# Altium project Laser.PrjPcb
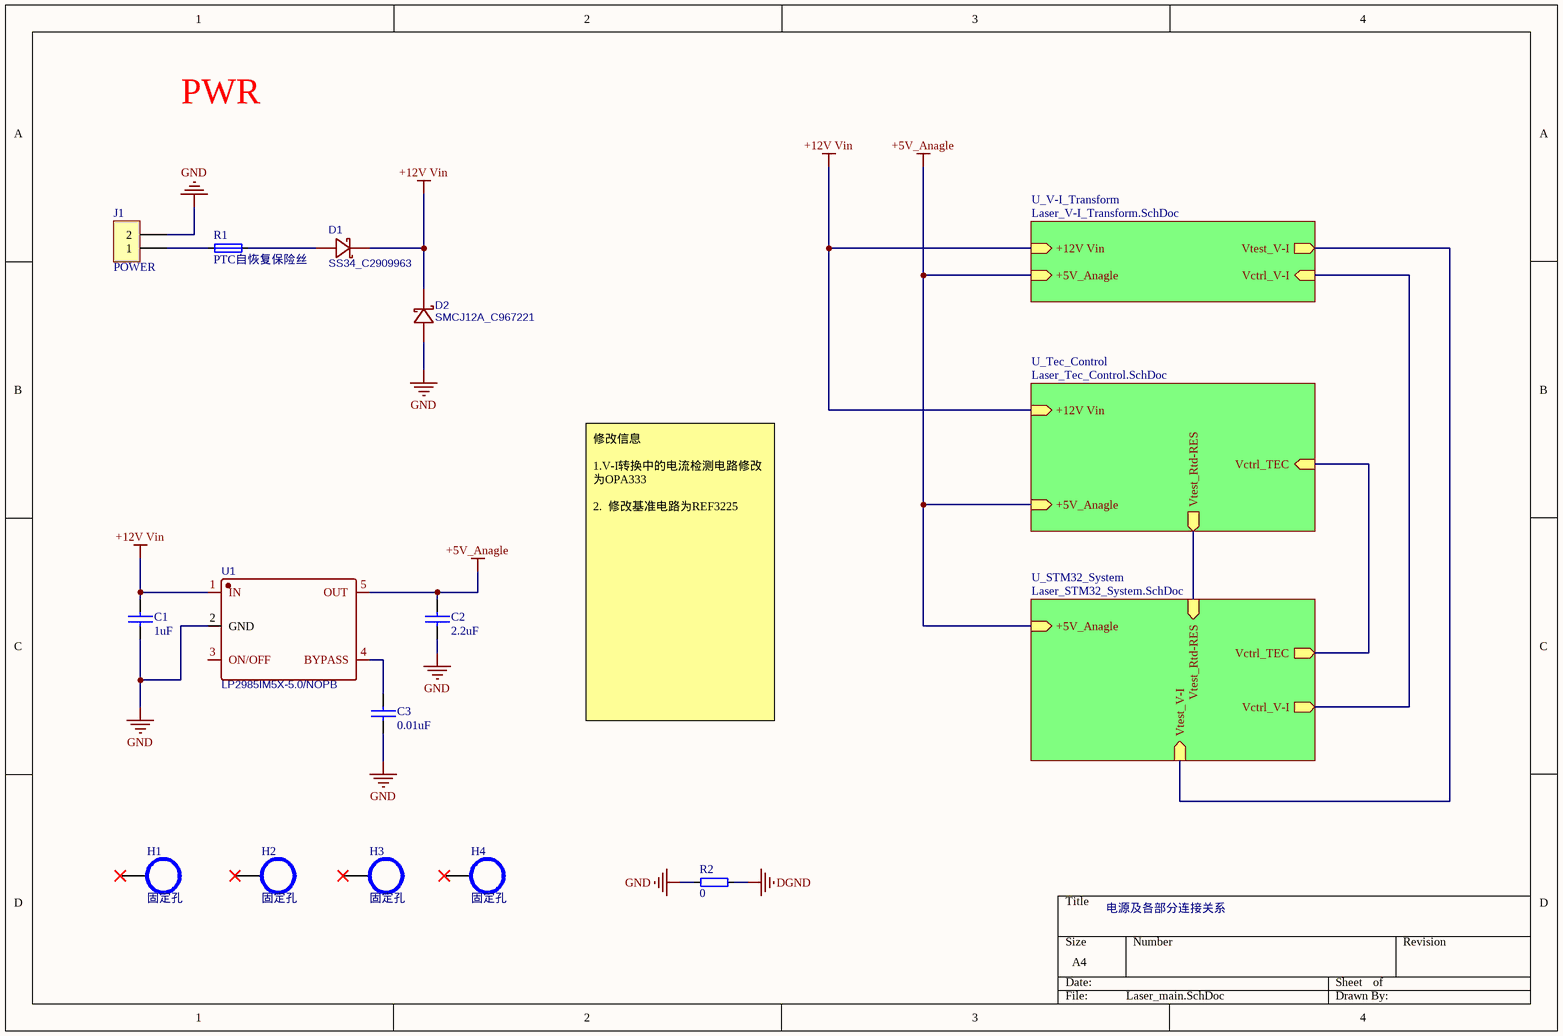
[diagram p0: Laser_main.SchDoc]
4 sheets, 112 parts. Net scope: hierarchical (ports join the sheet entries above them; power ports are global).
Board files: Laser_TFT_Display.PcbDoc, Laser.PcbDoc
Sheets:
  Laser_main.SchDoc
    U_V-I_Transform = Laser_V-I_Transform.SchDoc
    U_Tec_Control = Laser_Tec_Control.SchDoc
    U_STM32_System = Laser_STM32_System.SchDoc

## Sheet Laser_main.SchDoc: Main
size A4; SheetNumber: 1; SheetTotal: 4

### Parts
C1  1uF  [C 0603_M]
C2  2.2uF  [C 0603_M]
C3  0.01uF  [C 0603_M]
D1  SS34_C2909963  [SMA_L4.2-W2.7-LS5.0-RD]
D2  SMCJ12A_C967221  [SMC_L6.9-W5.9-LS8.0-RD]
H1  固定孔  [铜柱孔3]
H2  固定孔  [铜柱孔3]
H3  固定孔  [铜柱孔3]
H4  固定孔  [铜柱孔3]
J1  POWER  [KF128-5.08-2P]
R1  PTC自恢复保险丝  [0805R]
R2  0  [0603R]
U1  LP2985IM5X-5.0/NOPB  [SOT-23-5_L3.0-W1.7-P0.95-LS2.8-BR]

### Sub-sheets
U_STM32_System = Laser_STM32_System.SchDoc: +5V_Anagle (in), Vtest_Rtd-RES (in), Vtest_V-I (in), Vctrl_V-I (out), Vctrl_TEC (out)
U_Tec_Control = Laser_Tec_Control.SchDoc: +12V Vin (in), +5V_Anagle (in), Vctrl_TEC (in), Vtest_Rtd-RES (out)
U_V-I_Transform = Laser_V-I_Transform.SchDoc: Vctrl_V-I (in), Vtest_V-I (out), +5V_Anagle (in), +12V Vin (in)

### Nets
+5V_Anagle: C2.1 U1.5(OUT) ; sheet U_V-I_Transform/+5V_Anagle, sheet U_Tec_Control/+5V_Anagle, sheet U_STM32_System/+5V_Anagle
+12V Vin: C1.1 D1.1 D2.1(C) U1.1(IN) ; sheet U_V-I_Transform/+12V Vin, sheet U_Tec_Control/+12V Vin
DGND: R2.1
GND: C1.2 C2.2 C3.2 D2.2(A) J1.2 R2.2 U1.2(GND)
NetC3_1: C3.1 U1.4(BYPASS)
NetC8_1: sheet U_V-I_Transform/Vtest_V-I, sheet U_STM32_System/Vtest_V-I
NetC10_2: sheet U_V-I_Transform/Vctrl_V-I, sheet U_STM32_System/Vctrl_V-I
NetD1_2: D1.2 R1.2
NetJ1_1: J1.1 R1.1
NetJ3_1: sheet U_Tec_Control/Vtest_Rtd-RES, sheet U_STM32_System/Vtest_Rtd-RES
NetR21_1: sheet U_Tec_Control/Vctrl_TEC, sheet U_STM32_System/Vctrl_TEC

Not connected (* = marked no-connect by the designer): H1 11*; H2 11*; H3 11*; H4 11*; U1 3(ON/OFF)

### Notes on the sheet
- PWR
- 修改信息
  1.V-I转换中的电流检测电路修改为OPA333
  2.  修改基准电路为REF3225
- 电源及各部分连接关系

### Library data of the parts
C1-C3 = 普通电容: Capacitor
D1 = SS34_C2909963: BOM_Manufacturer: YONGYUTAI(永裕泰); BOM_Manufacturer Part: SS34; Contributor: LCSC; BOM_Supplier: LCSC; BOM_Supplier Part: C2909963; BOM_JLCPCB Part Class: Extended Part; spicePre: D; spiceSymbolName: SS34_C2909963
D2 = SMCJ12A_C967221: BOM_Manufacturer: Boarden(宝宫); Contributor: LCSC; BOM_Supplier: LCSC; BOM_Supplier Part: C967221; BOM_Manufacturer Part: SMCJ12A; spicePre: D; spiceSymbolName: SMCJ12A_C967221
J1 = SIP2: jointbar
R2 = 普通电阻: 电阻精度为0.1%
U1 = LP2985IM5X-5.0/NOPB: BOM_Manufacturer: Texas Instruments; Contributor: LCSC; BOM_Supplier: LCSC; BOM_Supplier Part: C73908; BOM_Manufacturer Part: LP2985IM5X-5.0/NOPB; BOM_JLCPCB Part Class: Extended Part; spicePre: U; spiceSymbolName: LP2985IM5X-5.0/NOPB

## Sheet Laser_V-I_Transform.SchDoc
size A4; SheetNumber: 2; SheetTotal: 4
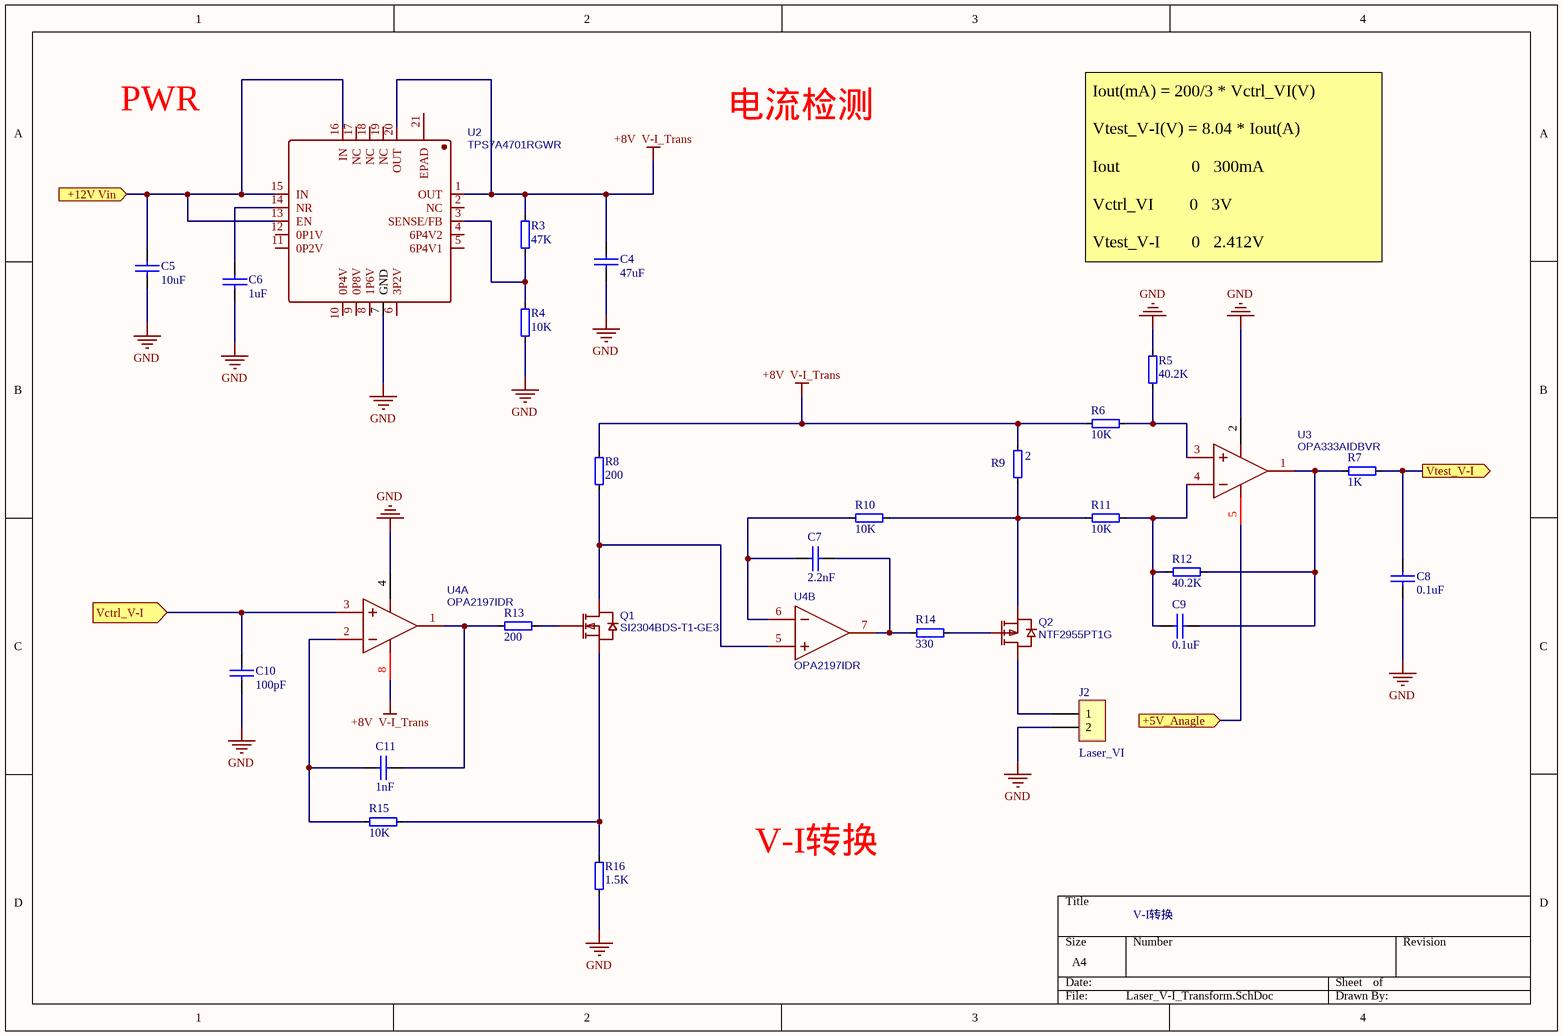
[diagram p1: Laser_V-I_Transform.SchDoc]

### Parts
C4  47uF  [C 0603_M]
C5  10uF  [C 0603_M]
C6  1uF  [C 0603_M]
C7  2.2nF  [C 0603_M]
C8  0.1uF  [C 0603_M]
C9  0.1uF  [C 0603_M]
C10  100pF  [C 0603_M]
C11  1nF  [C 0603_M]
J2  Laser_VI  [KF128-5.08-2P]
Q1  SI2304BDS-T1-GE3  [SOT-23_L2.9-W1.3-P1.90-LS2.4-BR]
Q2  NTF2955PT1G  [SOT-223-4_L6.5-W3.5-P2.30-LS7.0-BR]
R3  47K  [0603R]
R4  10K  [0603R]
R5  40.2K  [0603R]
R6  10K  [0603R]
R7  1K  [0603R]
R8  200  [0603R]
R9  2  [0603R]
R10  10K  [0603R]
R11  10K  [0603R]
R12  40.2K  [0603R]
R13  200  [0603R]
R14  330  [0603R]
R15  10K  [0603R]
R16  1.5K  [0603R]
U2  TPS7A4701RGWR  [VQFN-20_L5.0-W5.0-P0.65-TL-EP]
U3  OPA333AIDBVR  [SOT-23-5_L3.0-W1.7-P0.95-LS2.8-BR]
U4  OPA2197IDR  [SOIC-8_L4.9-W3.9-P1.27-LS6.0-BL]  (parts A,B of 2)

### Ports
+5V_Anagle (in), +12V Vin (in), Vctrl_V-I (in), Vtest_V-I (out)

### Nets
+5V_Anagle: U3.5(V+) ; port +5V_Anagle
+8V  V-I_Trans: C4.2 R3.2 R6.1 R8.1 R9.1 U2.1(OUT) U2.20(OUT) U4.8(V+)
+12V Vin: C5.1 U2.13(EN) U2.15(IN) U2.16(IN) ; port +12V Vin
GND: C4.1 C5.2 C6.2 C8.2 C10.1 J2.2 R4.1 R5.2 R16.2 U2.7(GND) U3.2(V-) U4.4(V-)
NetC6_1: C6.1 U2.14(NR)
NetC7_1: C7.1 R14.2 U4.7(OUT_A)
NetC7_2: C7.2 R10.1 U4.6(IN_A-)
NetC8_1: C8.1 R7.2 ; port Vtest_V-I
NetC9_1: C9.1 R7.1 R12.2 U3.1(OUT)
NetC9_2: C9.2 R11.2 R12.1 U3.4(IN-)
NetC10_2: C10.2 U4.3(IN_A+) ; port Vctrl_V-I
NetC11_1: C11.1 R13.2 U4.1(OUT_A)
NetC11_2: C11.2 R15.2 U4.2(IN_A-)
NetJ2_1: J2.1 Q2.2(D)
NetQ1_1: Q1.1(G) R13.1
NetQ1_2: Q1.2(S) R15.1 R16.1
NetQ1_3: Q1.3(D) R8.2 U4.5(IN_A+)
NetQ2_1: Q2.1(G) R14.1
NetQ2_3: Q2.3(S) R9.2 R10.2 R11.1
NetR3_1: R3.1 R4.2 U2.3(SENSE/FB)
NetR5_1: R5.1 R6.2 U3.3(IN+)

Not connected (* = marked no-connect by the designer): U2 2(NC) 4(6P4V2) 5(6P4V1) 6(3P2V) 8(1P6V) 9(0P8V) 10(0P4V) 11(0P2V) 12(0P1V) 17(NC) 18(NC) 19(NC) 21(EPAD)

### Notes on the sheet
- PWR
- 电流检测
- Iout(mA) = 200/3 * Vctrl_VI(V)
  Vtest_V-I(V) = 8.04 * Iout(A)
  Iout                0   300mA
  Vctrl_VI        0   3V
  Vtest_V-I       0   2.412V
- V-I转换

### Library data of the parts
C4-C11 = 普通电容: Capacitor
J2 = SIP2: jointbar
Q1 = SI2304BDS-T1-GE3: BOM_Manufacturer: VISHAY; BOM_Supplier: LCSC; BOM_Manufacturer Part: SI2304BDS-T1-GE3; BOM_Supplier Part: C81446; BOM_JLCPCB Part Class: Extended Part; spicePre: Q; spiceSymbolName: SI2304BDS-T1-GE3
Q2 = NTF2955PT1G: BOM_Manufacturer: VBsemi Elec; Contributor: LCSC; BOM_Supplier: LCSC; BOM_Supplier Part: C710036; BOM_Manufacturer Part: NTF2955PT1G; BOM_JLCPCB Part Class: Extended Part; spicePre: Q; spiceSymbolName: NTF2955PT1G
R3 R4 R8 R16 = 普通电阻: 电阻精度为0.1%
R5-R7 R10-R15 = 普通电阻
R9 = 采样电阻: 采样电阻，电阻精度为0.1%
U2 = TPS7A4701RGWR: BOM_Manufacturer: Texas Instruments; Contributor: LCSC; BOM_Supplier: LCSC; BOM_Supplier Part: C90084; BOM_Manufacturer Part: TPS7A4701RGWR; BOM_JLCPCB Part Class: Extended Part; spicePre: U; spiceSymbolName: TPS7A4701RGWR
U3 = OPA333AIDBVR: BOM_Manufacturer: TI; Contributor: LCSC; BOM_Supplier: LCSC; BOM_Manufacturer Part: OPA333AIDBVR; BOM_Supplier Part: C30878; BOM_JLCPCB Part Class: Extended Part; spicePre: U; spiceSymbolName: OPA333AIDBVR
U4 = OPA2197IDR: BOM_Manufacturer: TI; Contributor: LCSC; BOM_Supplier: LCSC; BOM_Manufacturer Part: OPA2197IDR; BOM_Supplier Part: C139363; BOM_JLCPCB Part Class: Extended Part; spicePre: U; spiceSymbolName: OPA2197IDR

## Sheet Laser_Tec_Control.SchDoc
size A4; SheetNumber: 3; SheetTotal: 4
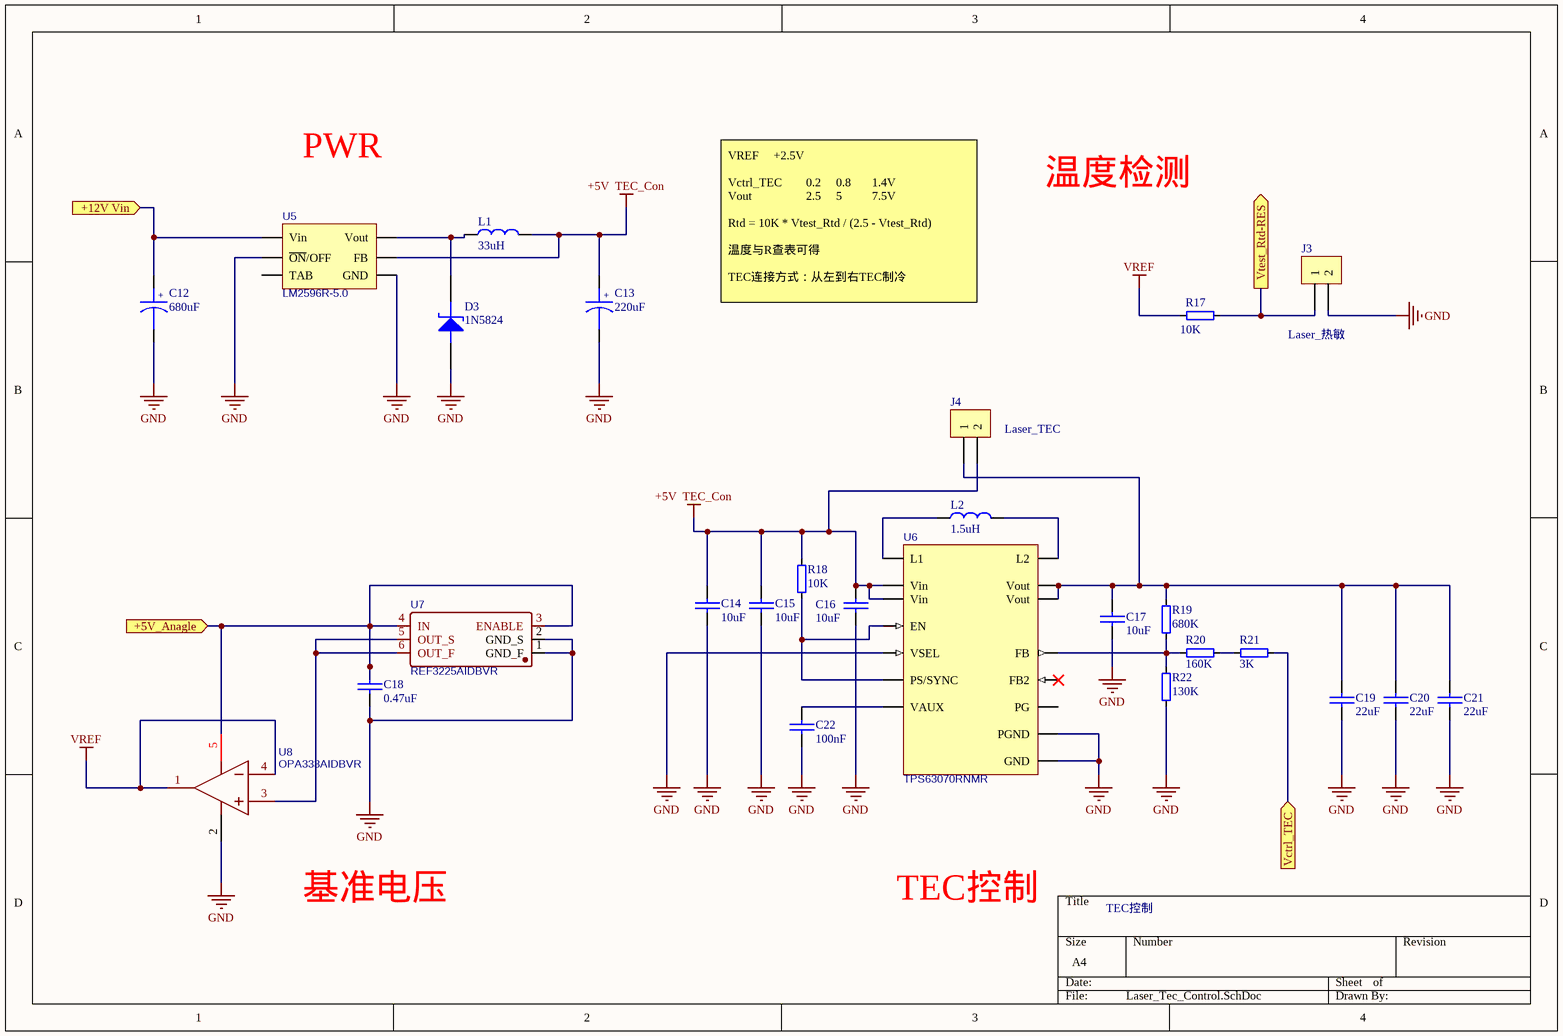
[diagram p2: Laser_Tec_Control.SchDoc]

### Parts
C12  680uF  [CAP-TH_BD8.0-P3.50-D0.6-FD]
C13  220uF  [CAP-TH_BD8.0-P3.50-D0.6-FD]
C14  10uF  [C 0603_M]
C15  10uF  [C 0603_M]
C16  10uF  [C 0603_M]
C17  10uF  [C 0603_M]
C18  0.47uF  [C 0603_M]
C19  22uF  [C 0603_M]
C20  22uF  [C 0603_M]
C21  22uF  [C 0603_M]
C22  100nF  [C 0603_M]
D3  1N5824  [SMA_L4.3-W2.6-LS5.0-RD]
J3  Laser_热敏  [KF128-5.08-2P]
J4  Laser_TEC  [KF128-5.08-2P]
L1  33uH  [L 0805]
L2  1.5uH  [L 0805]
R17  10K  [0603R]
R18  10K  [0603R]
R19  680K  [0603R]
R20  160K  [0603R]
R21  3K  [0603R]
R22  130K  [0603R]
U5  LM2596R-5.0  [TO-263-5_L10.2-W8.6-P1.70-LS14.4-TL]
U6  TPS63070RNMR  [VQFN-HR-15_L3.0-W2.5-P0.50-BL_TPS63070RNMR]
U7  REF3225AIDBVR  [SOT-23-6_L2.9-W1.6-P0.95-LS2.8-BL]
U8  OPA333AIDBVR  [SOT-23-5_L3.0-W1.7-P0.95-LS2.8-BR]

### Ports
+5V_Anagle (in), +12V Vin (in), Vctrl_TEC (in), Vtest_Rtd-RES (out)

### Nets
+5V  TEC_Con: C13.1 C14.1 C15.1 C16.1 J4.2 L1.1 R18.2 U5.4(FB) U6.12(Vin) U6.13(Vin)
+5V_Anagle: C18.1 U7.3(ENABLE) U7.4(IN) U8.5(V+) ; port +5V_Anagle
+12V Vin: C12.1 U5.1(Vin) ; port +12V Vin
GND: C12.2 C13.2 C14.2 C15.2 C16.2 C17.2 C18.2 C19.2 C20.2 C21.2 C22.2 D3.1(A) J3.2 R22.1 U5.3(GND) U5.5(~{ON}/OFF) U6.4(GND) U6.10(PGND) U6.15(VSEL) U7.1(GND_F) U7.2(GND_S) U8.2(V-)
VREF: R17.1 U8.1(OUT) U8.4(IN-)
NetC17_1: C17.1 C19.1 C20.1 C21.1 J4.1 R19.2 U6.7(Vout) U6.8(Vout)
NetC22_1: C22.1 U6.3(VAUX)
NetD3_2: D3.2(K) L1.2 U5.2(Vout)
NetJ3_1: J3.1 R17.2 ; port Vtest_Rtd-RES
NetL2_1: L2.1 U6.9(L2)
NetL2_2: L2.2 U6.11(L1)
NetR18_1: R18.1 U6.1(PS/SYNC) U6.14(EN)
NetR19_1: R19.1 R20.2 R22.2 U6.5(FB)
NetR20_1: R20.1 R21.2
NetR21_1: R21.1 ; port Vctrl_TEC
NetU7_5: U7.5(OUT_S) U7.6(OUT_F) U8.3(IN+)

Not connected (* = marked no-connect by the designer): U5 6(TAB); U6 2(PG) 6(FB2)*

### Notes on the sheet
- PWR
- 温度检测
- VREF     +2.5V
  Vctrl_TEC        0.2     0.8       1.4V
  Vout                  2.5     5          7.5V
  Rtd = 10K * Vtest_Rtd / (2.5 - Vtest_Rtd)
  温度与R查表可得
  TEC连接方式：从左到右TEC制冷
- 基准电压
- TEC控制
- (in symbol 电解电容1) +

### Library data of the parts
C12 C13 = 电解电容1: Capacitor
C14 C20 C21 = 普通电容: Capacitor 0805
C15 C19 = 普通电容: Capacitor,0805
C16 C17 = 普通电容: Capacitor,0603
C18 C22 = 普通电容: Capacitor
D3 = 1N5824: Zener Diode
J3 J4 = SIP2: jointbar
L1 L2 = L1: 电感
R17-R22 = 普通电阻
U5 = LM2596R-5.0: BOM_Manufacturer: HTC; BOM_Supplier: LCSC; BOM_Manufacturer Part: LM2596R-5.0; BOM_Supplier Part: C77782; BOM_JLCPCB Part Class: Extended Part; spicePre: U; spiceSymbolName: LM2596R-5.0
U6 = TPS63070RNMR: BOM_Manufacturer: TI; BOM_Supplier: LCSC; BOM_Manufacturer Part: TPS63070RNMR; BOM_Supplier Part: C109322; BOM_JLCPCB Part Class: Extended Part; spicePre: U; spiceSymbolName: TPS63070RNMR
U7 = REF3225AIDBVR: BOM_Manufacturer: TI; BOM_Supplier: LCSC; BOM_Manufacturer Part: REF3225AIDBVR; BOM_Supplier Part: C40852; BOM_JLCPCB Part Class: Extended Part; spicePre: U; spiceSymbolName: REF3225AIDBVR
U8 = OPA333AIDBVR: BOM_Manufacturer: TI; Contributor: LCSC; BOM_Supplier: LCSC; BOM_Manufacturer Part: OPA333AIDBVR; BOM_Supplier Part: C30878; BOM_JLCPCB Part Class: Extended Part; spicePre: U; spiceSymbolName: OPA333AIDBVR

## Sheet Laser_STM32_System.SchDoc
size A4; SheetNumber: 4; SheetTotal: 4
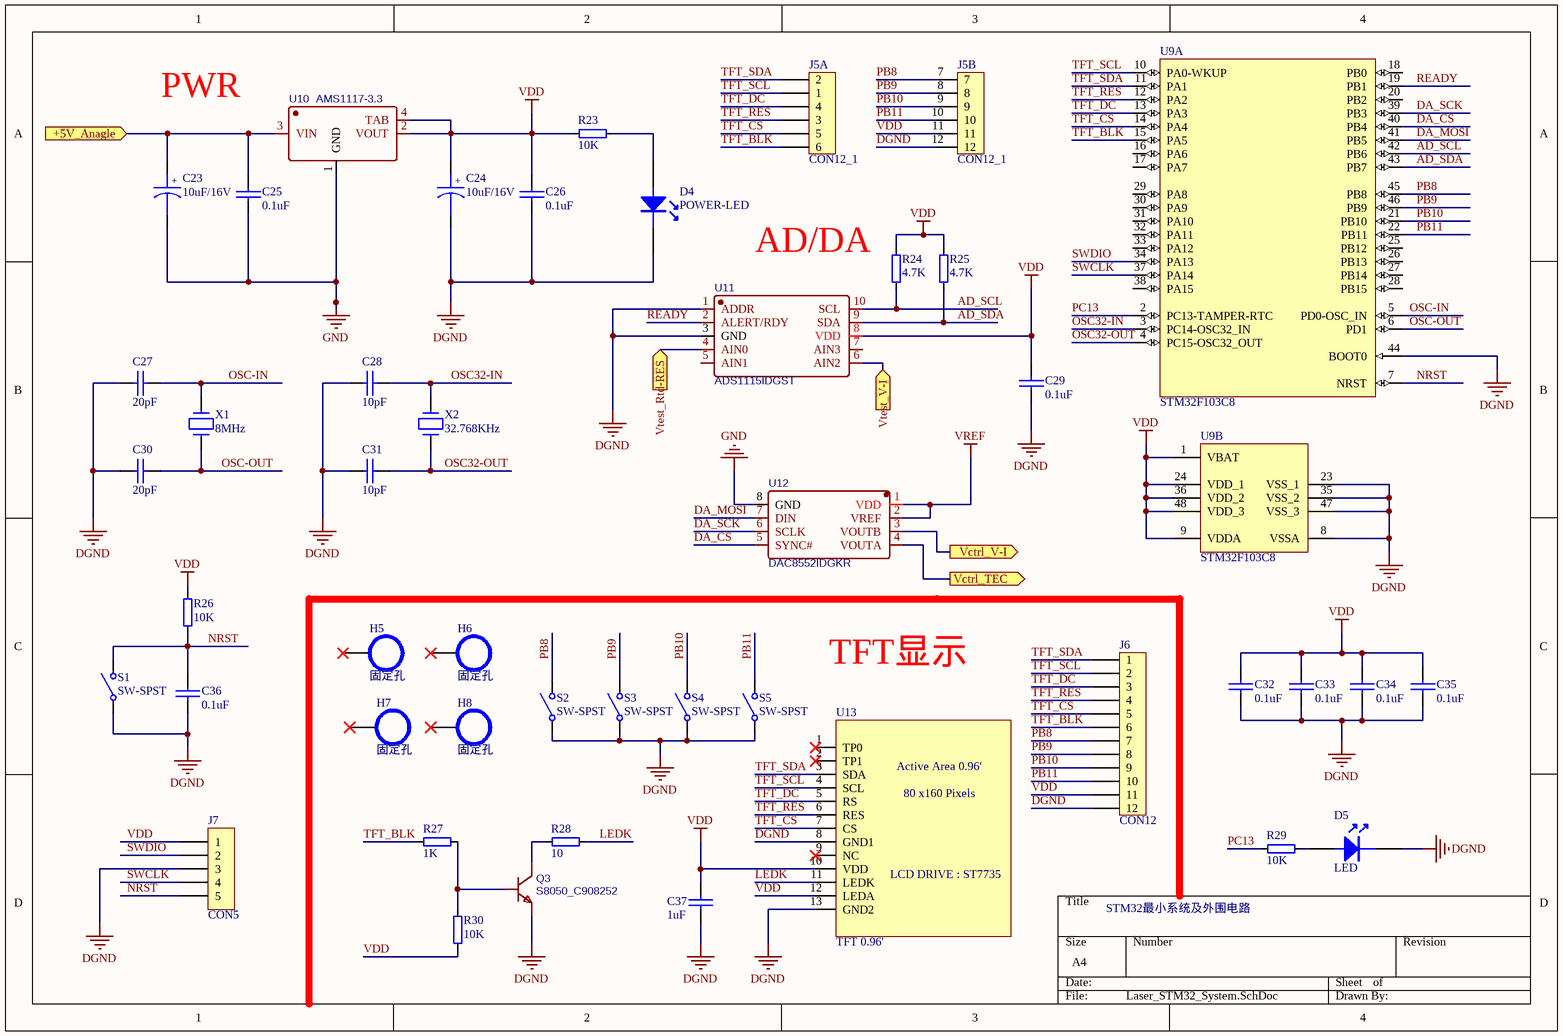
[diagram p3: Laser_STM32_System.SchDoc]

### Parts
C23  10uF/16V  [CAP-TH_BD5.0-P2.00-D0.8-FD]
C24  10uF/16V  [CAP-TH_BD5.0-P2.00-D0.8-FD]
C25  0.1uF  [C 0603_M]
C26  0.1uF  [C 0603_M]
C27  20pF  [C 0603_M]
C28  10pF  [C 0603_M]
C29  0.1uF  [C 0603_M]
C30  20pF  [C 0603_M]
C31  10pF  [C 0603_M]
C32  0.1uF  [C 0603_M]
C33  0.1uF  [C 0603_M]
C34  0.1uF  [C 0603_M]
C35  0.1uF  [C 0603_M]
C36  0.1uF  [C 0603_M]
C37  1uF  [C 0603_M]
D4  POWER-LED  [LED 0805R]
D5  LED  [LED 0805R]
H5  固定孔  [铜柱孔3]
H6  固定孔  [铜柱孔3]
H7  固定孔  [铜柱孔3]
H8  固定孔  [铜柱孔3]
J5  CON12_1  [XH2.54-WI-12P]  (parts A,B of 2)
J6  CON12  [XH2.54-WI-12P]
J7  CON5  [HDR2.54-LI-5P]
Q3  S8050_C908252  [SOT-23-3_L2.9-W1.3-P1.90-LS2.4-BR]
R23  10K  [0603R]
R24  4.7K  [0603R]
R25  4.7K  [0603R]
R26  10K  [0603R]
R27  1K  [0603R]
R28  10  [0603R]
R29  10K  [0603R]
R30  10K  [0603R]
S1  SW-SPST  [TSW SMD-3*6*2.5]
S2  SW-SPST  [TSW DIP-6*6*5]
S3  SW-SPST  [TSW DIP-6*6*5]
S4  SW-SPST  [TSW DIP-6*6*5]
S5  SW-SPST  [TSW DIP-6*6*5]
U9  STM32F103C8  [LQFP-48_L7.0-W7.0-P0.50-LS9.0-BL]  (parts A,B of 2)
U10  AMS1117-3.3  [SOT-223-4_L6.5-W3.5-P2.30-LS7.0-BR]
U11  ADS1115IDGST  [VSSOP-10_L3.0-W3.0-P0.50-LS4.9-BL]
U12  DAC8552IDGKR  [VSSOP-8_L3.0-W3.0-P0.65-LS5.0-BL]
U13  TFT 0.96'  [TFT0.96-13P]
X1  8MHz  [OSC HC-49S]
X2  32.768KHz  [OSC-3x8-LI]

### Ports
+5V_Anagle (in), Vctrl_TEC (out), Vctrl_V-I (out), Vtest_Rtd-RES (in), Vtest_V-I (in)

### Nets
+5V_Anagle: C23.1 C25.1 U10.3(VIN) ; port +5V_Anagle
DGND: C24.2 C26.2 C27.1 C28.1 C29.2 C30.1 C31.1 C32.2 C33.2 C34.2 C35.2 C36.2 C37.1 D4.2 D5.2 J5.12 J6.12 J7.3 Q3.2(E) S1.1(COMMON) S2.1(COMMON) S3.1(COMMON) S4.1(COMMON) S5.1(COMMON) U9.8(VSSA) U9.23(VSS_1) U9.35(VSS_2) U9.44(BOOT0) U9.47(VSS_3) U11.1(ADDR) U11.3(GND) U13.8(GND1) U13.13(GND2)
GND: C23.2 C25.2 U10.1(GND) U12.8(GND)
VDD: C24.1 C26.1 C29.1 C32.1 C33.1 C34.1 C35.1 C37.2 J5.11 J6.11 J7.1 R23.1 R24.2 R25.2 R26.2 R30.1 U9.1(VBAT) U9.9(VDDA) U9.24(VDD_1) U9.36(VDD_2) U9.48(VDD_3) U10.2(VOUT) U10.4(TAB) U11.8(VDD) U13.10(VDD) U13.12(LEDA)
VREF: U12.1(VDD) U12.2(VREF)
AD_SCL: R24.1 U9.42(PB6) U11.10(SCL)
AD_SDA: R25.1 U9.43(PB7) U11.9(SDA)
DA_~{CS}: U9.40(PB4) U12.5(SYNC#)
DA_MOSI: U9.41(PB5) U12.7(DIN)
DA_SCK: U9.39(PB3) U12.6(SCLK)
LEDK: R28.2 U13.11(LEDK)
NRST: C36.1 J7.5 R26.1 S1.2(NO) U9.7(NRST)
OSC32-IN: C28.2 U9.3(PC14-OSC32_IN) X2.2
OSC32-OUT: C31.2 U9.4(PC15-OSC32_OUT) X2.1
OSC-IN: C27.2 U9.5(PD0-OSC_IN) X1.2
OSC-OUT: C30.2 U9.6(PD1) X1.1
PB8: J5.7 J6.7 S2.2(NO) U9.45(PB8)
PB9: J5.8 J6.8 S3.2(NO) U9.46(PB9)
PB10: J5.9 J6.9 S4.2(NO) U9.21(PB10)
PB11: J5.10 J6.10 S5.2(NO) U9.22(PB11)
PC13: R29.1 U9.2(PC13-TAMPER-RTC)
READY: U9.19(PB1) U11.2(ALERT/RDY)
SWCLK: J7.4 U9.37(PA14)
SWDIO: J7.2 U9.34(PA13)
TFT_BLK: J5.6 J6.6 R27.1 U9.15(PA5)
TFT_CS: J5.5 J6.5 U9.14(PA4) U13.7(CS)
TFT_DC: J5.4 J6.3 U9.13(PA3) U13.5(RS)
TFT_RES: J5.3 J6.4 U9.12(PA2) U13.6(RES)
TFT_SCL: J5.1 J6.2 U9.10(PA0-WKUP) U13.4(SCL)
TFT_SDA: J5.2 J6.1 U9.11(PA1) U13.3(SDA)
NetC8_1: U11.6(AIN2) ; port Vtest_V-I
NetC10_2: U12.3(VOUTB) ; port Vctrl_V-I
NetD4_1: D4.1 R23.2
NetD5_1: D5.1 R29.2
NetJ3_1: U11.4(AIN0) ; port Vtest_Rtd-RES
NetQ3_1: Q3.1(B) R27.2 R30.2
NetQ3_3: Q3.3(C) R28.1
NetR21_1: U12.4(VOUTA) ; port Vctrl_TEC

Not connected (* = marked no-connect by the designer): H5 11*; H6 11*; H7 11*; H8 11*; U9 16(PA6) 17(PA7) 18(PB0) 20(PB2) 25(PB12) 26(PB13) 27(PB14) 28(PB15) 29(PA8) 30(PA9) 31(PA10) 32(PA11) 33(PA12) 38(PA15); U11 5(AIN1) 7(AIN3); U13 1(TP0)* 2(TP1)* 9(NC)*

### Notes on the sheet
- PWR
- AD/DA
- TFT显示
- STM32最小系统及外围电路
- (in symbol TFT显示屏) Active Area 0.96'; 80 x160 Pixels; LCD DRIVE : ST7735
- (in symbol 电解电容1) +

### Library data of the parts
C23 C24 = 电解电容1: Capacitor
C25-C37 = 普通电容: Capacitor
D4 D5 = 发光二极管
J5 = CON12_1: Connector
J6 = CON12: Connector
J7 = CON5: Connector
Q3 = S8050_C908252: BOM_Manufacturer: FUXINSEMI; BOM_Manufacturer Part: S8050; Contributor: LCSC; BOM_Supplier: LCSC; BOM_Supplier Part: C908252; BOM_JLCPCB Part Class: Extended Part; spicePre: Q; spiceSymbolName: S8050_C908252
R23-R30 = 普通电阻
S1-S5 = SW-SPST: Single-Pole, Single-Throw Switch; Published: 24-Mar-1999; LatestRevisionDate: 17-Jul-2002; LatestRevisionNote: Re-released for DXP Platform.; PackageReference: SPST-2; Publisher: Altium Limited
U9 = STM32F103C8_A: Flaah:64/RAM:20/IO:36; BOM名称: 32位STM单片机; 版权归属: 源创客; 学习资源: www.ooocke.com
U10 = AMS1117-3.3: BOM_Manufacturer: Youtai Semiconductor Co., Ltd.; Contributor: LCSC; BOM_Supplier: LCSC; BOM_Supplier Part: C347256; BOM_Manufacturer Part: AMS1117-3.3; BOM_JLCPCB Part Class: Extended Part; spicePre: U; spiceSymbolName: AMS1117-3.3_C347256
U11 = ADS1115IDGST: BOM_Manufacturer: Texas Instruments; Contributor: LCSC; BOM_Supplier: LCSC; BOM_Supplier Part: C468683; BOM_Manufacturer Part: ADS1115IDGST; BOM_JLCPCB Part Class: Extended Part; spicePre: U; spiceSymbolName: ADS1115IDGST
U12 = DAC8552IDGKR: BOM_Manufacturer: Texas Instruments; Contributor: LCSC; BOM_Supplier: LCSC; BOM_Supplier Part: C136020; BOM_Manufacturer Part: DAC8552IDGKR; BOM_JLCPCB Part Class: Extended Part; spicePre: U; spiceSymbolName: DAC8552IDGKR
U13 = TFT显示屏
X1 X2 = CRYSTAL

## Nets that join several sheets
+5V_Anagle: Laser_main (C2.1 U1.5), Laser_V-I_Transform (U3.5), Laser_Tec_Control (C18.1 U7.3 U7.4 U8.5), Laser_STM32_System (C23.1 C25.1 U10.3)
+12V Vin: Laser_main (C1.1 D1.1 D2.1 U1.1), Laser_V-I_Transform (C5.1 U2.13 U2.15 U2.16), Laser_Tec_Control (C12.1 U5.1)
DGND: Laser_main (R2.1), Laser_STM32_System (33 pins)
GND: Laser_main (7 pins), Laser_V-I_Transform (12 pins), Laser_Tec_Control (22 pins), Laser_STM32_System (C23.2 C25.2 U10.1 U12.8)
VREF: Laser_Tec_Control (R17.1 U8.1 U8.4), Laser_STM32_System (U12.1 U12.2)
NetC8_1: Laser_V-I_Transform (C8.1 R7.2), Laser_STM32_System (U11.6)
NetC10_2: Laser_V-I_Transform (C10.2 U4.3), Laser_STM32_System (U12.3)
NetJ3_1: Laser_Tec_Control (J3.1 R17.2), Laser_STM32_System (U11.4)
NetR21_1: Laser_Tec_Control (R21.1), Laser_STM32_System (U12.4)